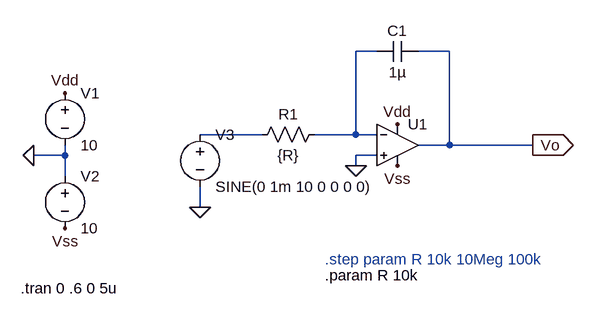
[diagram p0: schematic Ideal opamp inverting integrator.asc]
Ideal opamp inverting integrator.asc, the LTspice schematic file:
Version 4
SHEET 1 880 680
WIRE 464 32 432 32
WIRE 576 32 528 32
WIRE 288 160 192 160
WIRE 432 160 432 32
WIRE 432 160 368 160
WIRE 464 160 432 160
WIRE 576 176 576 32
WIRE 576 176 528 176
WIRE 704 176 576 176
WIRE -16 192 -16 176
WIRE -16 192 -64 192
WIRE 464 192 432 192
WIRE 432 208 432 192
WIRE -16 224 -16 192
WIRE 192 272 192 240
FLAG -64 192 0
FLAG -16 96 Vdd
FLAG 496 144 Vdd
FLAG -16 304 Vss
FLAG 496 208 Vss
FLAG 432 208 0
FLAG 192 272 0
FLAG 704 176 Vo
IOPIN 704 176 Out
SYMBOL voltage -16 80 R0
WINDOW 123 0 0 Left 0
WINDOW 39 0 0 Left 0
SYMATTR InstName V1
SYMATTR Value 10
SYMBOL voltage -16 208 R0
WINDOW 123 0 0 Left 0
WINDOW 39 0 0 Left 0
SYMATTR InstName V2
SYMATTR Value 10
SYMBOL Opamps\\UniversalOpamp2 496 176 R0
SYMATTR InstName U1
SYMBOL res 384 144 R90
WINDOW 0 0 56 VBottom 2
WINDOW 3 32 56 VTop 2
SYMATTR InstName R1
SYMATTR Value {R}
SYMBOL cap 528 16 R90
WINDOW 0 0 32 VBottom 2
WINDOW 3 32 32 VTop 2
SYMATTR InstName C1
SYMATTR Value 1µ
SYMBOL voltage 192 144 R0
WINDOW 123 0 0 Left 0
WINDOW 39 0 0 Left 0
SYMATTR InstName V3
SYMATTR Value SINE(0 1m 10 0 0 0 0)
TEXT 384 352 Left 2 ;.step param R 10k 10Meg 100k
TEXT 384 376 Left 2 !.param R 10k
TEXT -84 396 Left 2 !.tran 0 .6 0 5u

The netlist it stands for:
* Ideal opamp inverting integrator.asc
V1 Vdd 0 10
V2 0 Vss 10
XU1 0 N001 Vdd Vss Vo level.2 Avol=1Meg GBW=10Meg Slew=10Meg ilimit=25m rail=0 Vos=0 phimargin=45 en=0 enk=0 in=0 ink=0 Rin=500Meg  ; pins IN+ IN- V+ V- OUT
R1 N001 N002 {R}
C1 Vo N001 1µ
V3 N002 0 SINE(0 1m 10 0 0 0 0)
* .step param R 10k 10Meg 100k
.param R 10k
.tran 0 .6 0 5u
.lib UniversalOpamps2.sub
.backanno
.end